# Altium schematic sheet Safety Loops.SchDoc
size A3
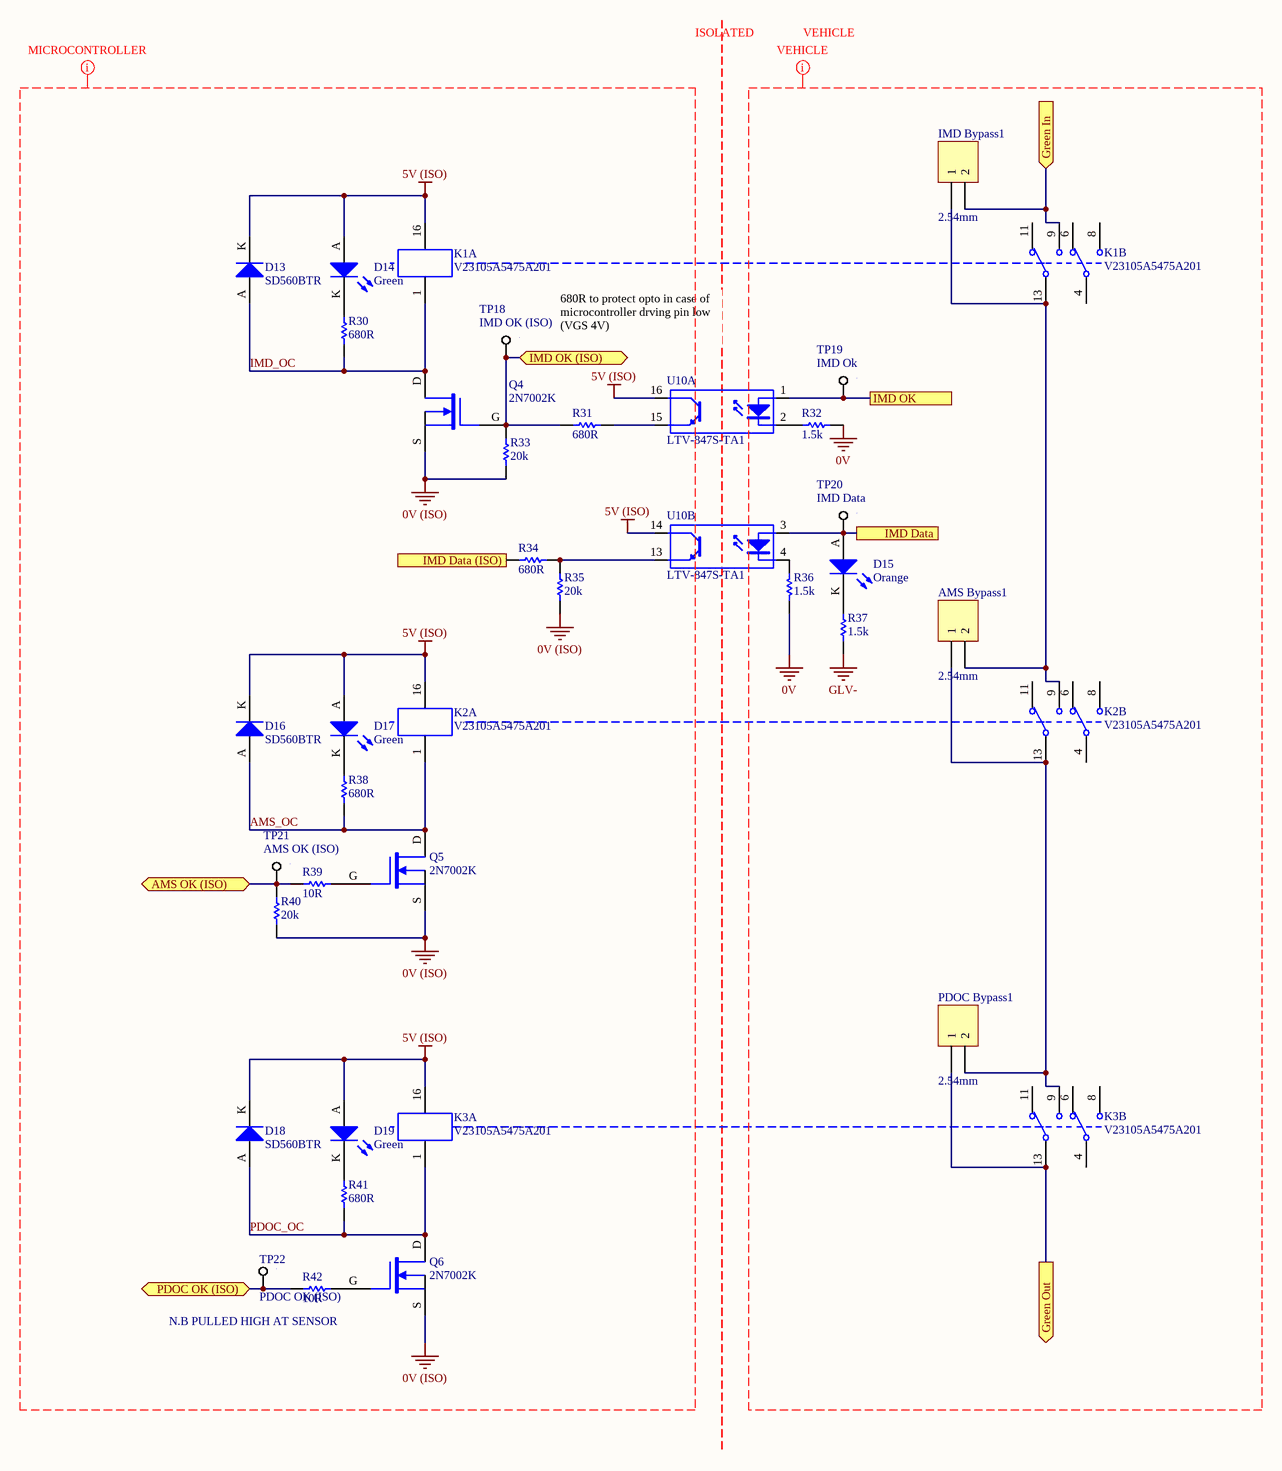
[diagram p0: Safety Loops.SchDoc]

## Parts
AMS_Bypass1  2.54mm  [TH 2.54mm Header 1x2]
D13  SD560BTR  [SMB Diode]
D14  Green  [0805 LED]
D15  Orange  [0805 LED]
D16  SD560BTR  [SMB Diode]
D17  Green  [0805 LED]
D18  SD560BTR  [SMB Diode]
D19  Green  [0805 LED]
IMD_Bypass1  2.54mm  [TH 2.54mm Header 1x2]
K1  V23105A5475A201  [TI 2-DIL]  (parts A,B of 2)
K2  V23105A5475A201  [TI 2-DIL]  (parts A,B of 2)
K3  V23105A5475A201  [TI 2-DIL]  (parts A,B of 2)
PDOC_Bypass1  2.54mm  [TH 2.54mm Header 1x2]
Q4  2N7002K  [ON SOT-23 MOSFET]
Q5  2N7002K  [ON SOT-23 MOSFET]
Q6  2N7002K  [ON SOT-23 MOSFET]
R30  680R  [0805]
R31  680R  [0805]
R32  1.5k  [0805]
R33  20k  [0805]
R34  680R  [0805]
R35  20k  [0805]
R36  1.5k  [0805]
R37  1.5k  [0805]
R38  680R  [0805]
R39  10R  [0805]
R40  20k  [0805]
R41  680R  [0805]
R42  10R  [0805]
TP18  IMD OK (ISO)  [SMD Test Point 1mm]
TP19  IMD Ok  [SMD Test Point 1mm]
TP20  IMD Data  [SMD Test Point 1mm]
TP21  AMS OK (ISO)  [SMD Test Point 1mm]
TP22  PDOC OK (ISO)  [SMD Test Point 1mm]
U10  LTV-847S-TA1  [ON 16-SMD]  (parts A,B of 4)

## Ports
AMS OK (ISO) (bidir), Green In (in), Green Out (out), IMD Data, IMD Data (ISO), IMD OK, IMD OK (ISO) (bidir), PDOC OK (ISO) (bidir)

## Nets
0V: R32.1 R36.2
0V (ISO): Q4.S Q5.S Q6.S R33.1 R35.1 R40.1
5V (ISO): D13.K D14.A D16.K D17.A D18.K D19.A K1.16 K2.16 K3.16 U10.14(C) U10.16(C)
GLV-: R37.2
AMS OK (ISO): R39.1 R40.2 TP21.1 ; port AMS OK (ISO)
AMS_OC: D16.A K2.1 Q5.D R38.1
Green In: IMD_Bypass1.2 K1.9 ; port Green In
Green Out: K3.13 PDOC_Bypass1.1 ; port Green Out
IMD Data: D15.A TP20.1 U10.3(A) ; port IMD Data
IMD Data (ISO): R34.1 ; port IMD Data (ISO)
IMD OK: TP19.1 U10.1(A) ; port IMD OK
IMD OK (ISO): Q4.G R31.1 R33.2 TP18.1 ; port IMD OK (ISO)
IMD_OC: D13.A K1.1 Q4.D R30.1
PDOC OK (ISO): R42.1 TP22.1 ; port PDOC OK (ISO)
PDOC_OC: D18.A K3.1 Q6.D R41.1
NetAMS_Bypass1_1: AMS_Bypass1.1 K2.13 K3.9 PDOC_Bypass1.2
NetAMS_Bypass1_2: AMS_Bypass1.2 IMD_Bypass1.1 K1.13 K2.9
NetD14_K: D14.K R30.2
NetD15_K: D15.K R37.1
NetD17_K: D17.K R38.2
NetD19_K: D19.K R41.2
NetQ5_G: Q5.G R39.2
NetQ6_G: Q6.G R42.2
NetR31_2: R31.2 U10.15(E)
NetR32_2: R32.2 U10.2(K)
NetR34_2: R34.2 R35.2 U10.13(E)
NetR36_1: R36.1 U10.4(K)

Not connected (* = marked no-connect by the designer): K1 4 6 8 11; K2 4 6 8 11; K3 4 6 8 11

## Layout directives
net class MICROCONTROLLER: 0V (ISO), 5V (ISO), AMS_OC, IMD_OC, PDOC_OC
net class VEHICLE: 0V, GLV-

## Notes on the sheet
- ISOLATED
- VEHICLE
- 680R to protect opto in case of microcontroller drving pin low (VGS 4V)
- N.B PULLED HIGH AT SENSOR
- Title
- Size:
- Date:
- A3
- Number:
- Time:
- Revision:
- Sheet
- of
- File:

## Library data of the parts
AMS_Bypass1 IMD_Bypass1 PDOC_Bypass1 = TH 2.54mm Header 1x2: Positions: 2; Angle: 0; Flange: No; Contact: NA; Part Number: TH 2.54mm Header 1x2; Pitch: 2.54mm; Row Spacing: 2.54mm
D13 D16 D18 = SD560BTR: 1.2V_F 600V 5A SMB; Manufacturer: SMC Diode Solutions; Part Number: SD560BTR; Digikey Part Number: 1655-1530-2-ND; Digikey Link: https://www.digikey.com/product-detail/en/smc-diode-solutions/SD560BTR/1655-1530-2-ND/6022620
D14 D17 D19 = SML-210FTT86: Green LED Indication - Discrete 1.75V 0805 (2012 Metric); Manufacturer: ROHM Semiconductor; Part Number: SML-210FTT86; Colour: Green; Digikey Part Number: 511-1285-1-ND; Digikey Link: https://www.digikey.com/product-detail/en/rohm-semiconductor/SML-210FTT86/511-1285-1-ND/637098
D15 = SML-211DTT86: Orange LED Indication - Discrete 1.75V 0805 (2012 Metric); Manufacturer: ROHM Semiconductor; Part Number: SML-211DTT86; Colour: Orange; Digikey Part Number: 511-1291-1-ND; Digikey Link: https://www.digikey.com/product-detail/en/rohm-semiconductor/SML-211DTT86/511-1291-1-ND/637104
K1-K3 = V23105A5475A201: 5V DPDT Relay 3A 220VDC; Manufacturer: Axicom; Part Number: V23105A5475A201; Digikey Part Number: PB383-ND; Digikey Link: https://www.digikey.com/products/en?mpart=V23105A5001A201&v=41
Q4-Q6 = 2N7002K: 60V 380mA, NFET MOSTFET (Small Signal); Manufacturer: ON Semiconductor; Published: 24-Mar-1999; LatestRevisionDate: 29-May-2009; LatestRevisionNote: IPC-7351 Footprint Added.; PackageVersion: Sep-2000; PackageReference: SOT-343; Publisher: Altium Limited; PackageDescription: 4-Pin SOT-343 Package 1.3 mm Pitch, 2.1 mm Lead Span; Part Number: 2N7002K; Digikey Part Number: 2N7002KCT-ND; Digikey Link: https://www.digikey.com/product-detail/en/on-semiconductor/2N7002K/2N7002KCT-ND/2060375; Qty: 30
R30 R31 R34 R38 R41 = RC0805FR07680RL: Manufacturer: YAGEO; Tolerance: 0.01; Rated Voltage: 0.125W; Part Number: RC0805FR07680RL; Value: 680R; Material: FR-07; Digikey Part Number: 311-680CRCT-ND
R32 R36 R37 = RC0805FR071K5L: Manufacturer: YAGEO; Tolerance: 0.01; Rated Voltage: 0.125W; Part Number: RC0805FR071K5L; Value: 1.5k; Material: FR-07; Digikey Part Number: 311-1.50KCRCT-ND
R33 R35 R40 = RC0805FR0720KL: Manufacturer: YAGEO; Tolerance: 0.01; Rated Voltage: 0.125W; Part Number: RC0805FR0720KL; Value: 20k; Material: FR-07; Digikey Part Number: 311-20.0KCRCT-ND
R39 R42 = RC0805FR0710RL: Manufacturer: YAGEO; Tolerance: 0.01; Rated Voltage: 0.125W; Part Number: RC0805FR0710RL; Value: 10R; Material: FR-07; Digikey Part Number: 311-10.0CRCT-ND
TP18-TP22 = SMD Test Point Small: Positions: 1; Pitch: 0mm; Row Spacing: 0; Flange: No; Contact: NA; Part Number: SMD Test Point Small; Angle: 0
U10 = LTV-847S-TA1: Optoisolator Transistor Output 5000Vrms 4 Channel 16-SMD; Manufacturer: Lite-On Inc; Part Number: LTV-847S-TA1; Digikey Part Number: 160-1371-5-ND; Digikey Link: https://www.digikey.com.au/product-detail/en/lite-on-inc/LTV-847S/160-1371-5-ND/385841